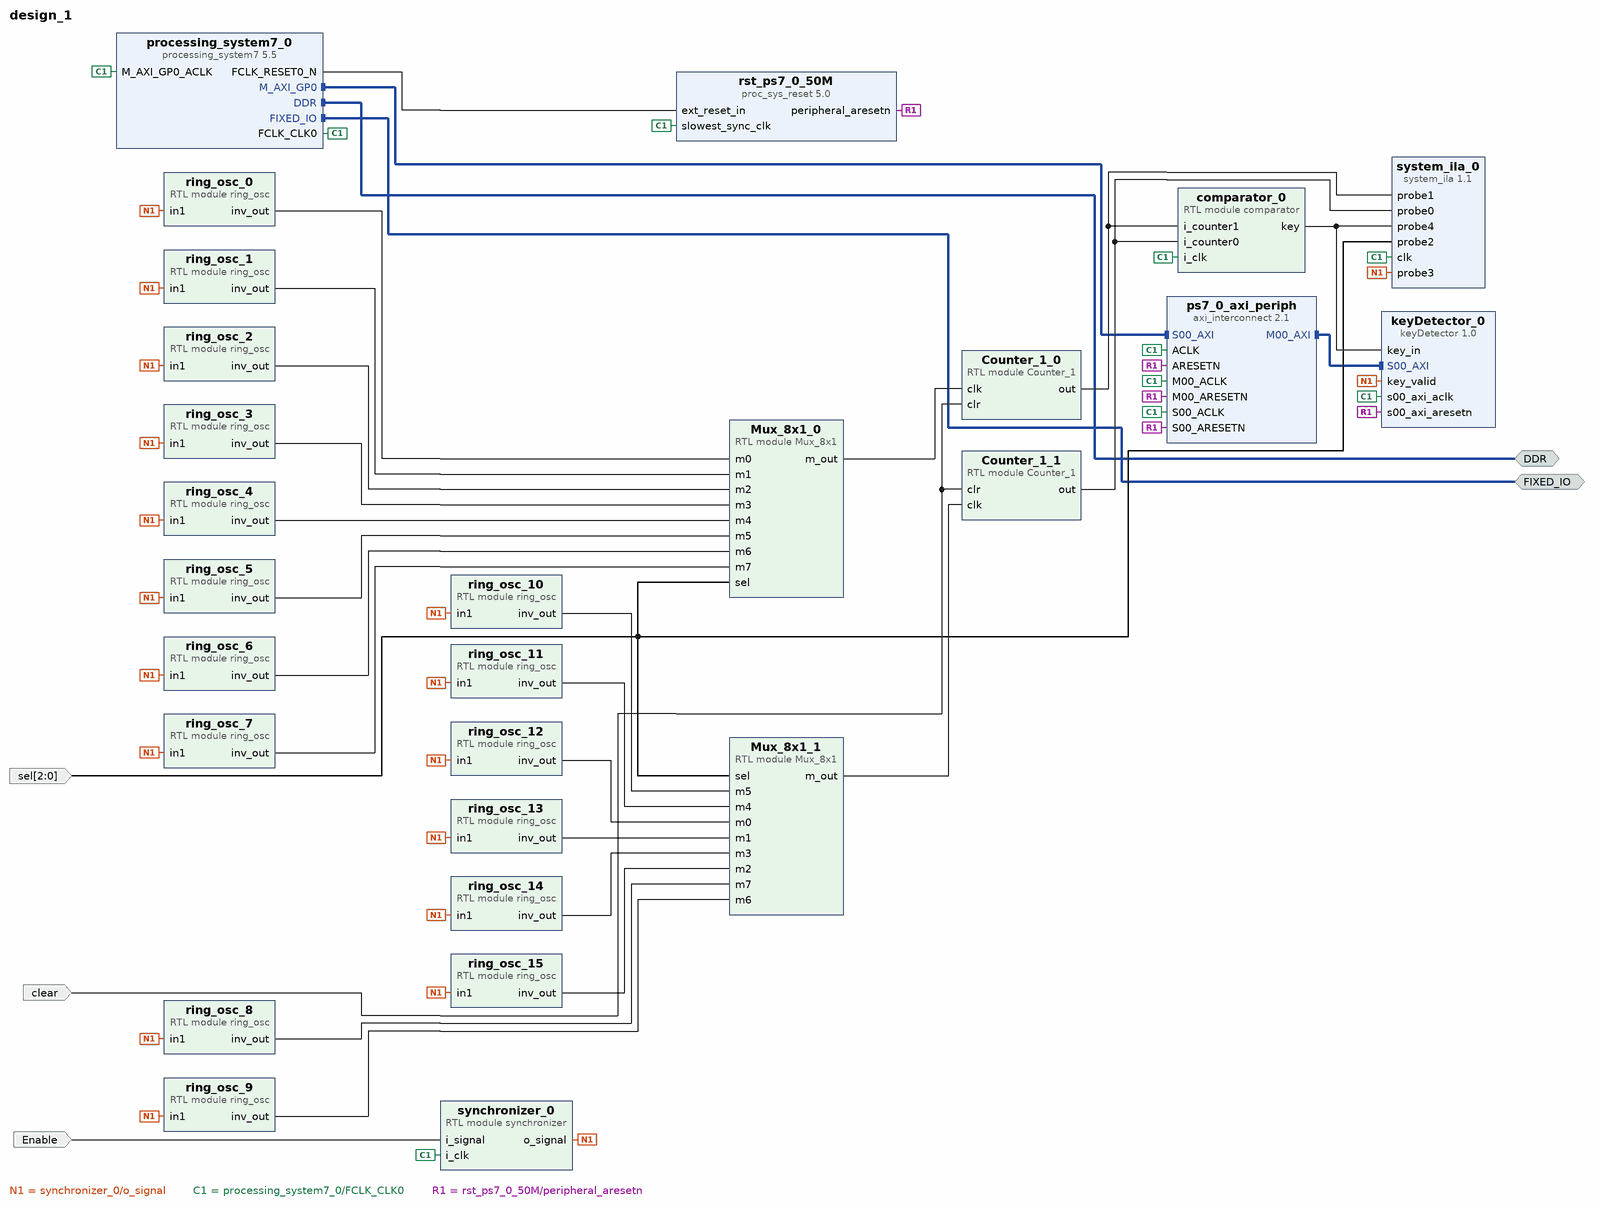
[diagram p0: block diagram of the top level]
# Vivado block design design_1, xc7z020clg400-1, Vivado 2021.1
create_bd_design design_1

create_bd_intf_port -mode Master -vlnv xilinx.com:interface:ddrx_rtl:1.0 DDR
create_bd_intf_port -mode Master -vlnv xilinx.com:display_processing_system7:fixedio_rtl:1.0 FIXED_IO
create_bd_port -dir I Enable
create_bd_port -dir I clear
create_bd_port -dir I -from 2 -to 0 sel

create_bd_cell -type ip -vlnv xilinx.com:ip:processing_system7:5.5 processing_system7_0
set_property -dict [list \
  CONFIG.PCW_APU_PERIPHERAL_FREQMHZ 666.666666 \
  CONFIG.PCW_CAN0_CAN0_IO {MIO 46 .. 47} \
  CONFIG.PCW_CAN0_PERIPHERAL_ENABLE 1 \
  CONFIG.PCW_CAN_PERIPHERAL_FREQMHZ 23.8095 \
  CONFIG.PCW_ENET0_ENET0_IO {MIO 16 .. 27} \
  CONFIG.PCW_ENET0_GRP_MDIO_ENABLE 1 \
  CONFIG.PCW_ENET0_GRP_MDIO_IO {MIO 52 .. 53} \
  CONFIG.PCW_ENET0_PERIPHERAL_ENABLE 1 \
  CONFIG.PCW_ENET0_PERIPHERAL_FREQMHZ {100 Mbps} \
  CONFIG.PCW_ENET0_RESET_ENABLE 1 \
  CONFIG.PCW_ENET0_RESET_IO {MIO 11} \
  CONFIG.PCW_ENET_RESET_ENABLE 1 \
  CONFIG.PCW_ENET_RESET_SELECT {Share reset pin} \
  CONFIG.PCW_FPGA0_PERIPHERAL_FREQMHZ 50 \
  CONFIG.PCW_FPGA1_PERIPHERAL_FREQMHZ 50 \
  CONFIG.PCW_GPIO_MIO_GPIO_ENABLE 1 \
  CONFIG.PCW_GPIO_MIO_GPIO_IO MIO \
  CONFIG.PCW_I2C0_GRP_INT_ENABLE 0 \
  CONFIG.PCW_I2C0_I2C0_IO {MIO 50 .. 51} \
  CONFIG.PCW_I2C0_PERIPHERAL_ENABLE 1 \
  CONFIG.PCW_I2C0_RESET_ENABLE 1 \
  CONFIG.PCW_I2C0_RESET_IO {MIO 13} \
  CONFIG.PCW_I2C_PERIPHERAL_FREQMHZ 111.111115 \
  CONFIG.PCW_I2C_RESET_ENABLE 1 \
  CONFIG.PCW_I2C_RESET_SELECT {Share reset pin} \
  CONFIG.PCW_PERIPHERAL_BOARD_PRESET part0 \
  CONFIG.PCW_PRESET_BANK0_VOLTAGE {LVCMOS 1.8V} \
  CONFIG.PCW_PRESET_BANK1_VOLTAGE {LVCMOS 1.8V} \
  CONFIG.PCW_QSPI_GRP_FBCLK_ENABLE 1 \
  CONFIG.PCW_QSPI_GRP_FBCLK_IO {MIO 8} \
  CONFIG.PCW_QSPI_GRP_SINGLE_SS_ENABLE 1 \
  CONFIG.PCW_QSPI_GRP_SINGLE_SS_IO {MIO 1 .. 6} \
  CONFIG.PCW_QSPI_PERIPHERAL_ENABLE 1 \
  CONFIG.PCW_QSPI_QSPI_IO {MIO 1 .. 6} \
  CONFIG.PCW_SD0_GRP_CD_ENABLE 1 \
  CONFIG.PCW_SD0_GRP_CD_IO {MIO 0} \
  CONFIG.PCW_SD0_GRP_WP_ENABLE 1 \
  CONFIG.PCW_SD0_GRP_WP_IO {MIO 15} \
  CONFIG.PCW_SD0_PERIPHERAL_ENABLE 1 \
  CONFIG.PCW_SD0_SD0_IO {MIO 40 .. 45} \
  CONFIG.PCW_SDIO_PERIPHERAL_FREQMHZ 50 \
  CONFIG.PCW_SINGLE_QSPI_DATA_MODE x4 \
  CONFIG.PCW_TTC0_PERIPHERAL_ENABLE 1 \
  CONFIG.PCW_TTC0_TTC0_IO EMIO \
  CONFIG.PCW_UART1_PERIPHERAL_ENABLE 1 \
  CONFIG.PCW_UART1_UART1_IO {MIO 48 .. 49} \
  CONFIG.PCW_UART_PERIPHERAL_FREQMHZ 50 \
  CONFIG.PCW_UIPARAM_DDR_FREQ_MHZ 533.333333 \
  CONFIG.PCW_UIPARAM_DDR_PARTNO {MT41K256M16 RE-125} \
  CONFIG.PCW_USB0_PERIPHERAL_ENABLE 1 \
  CONFIG.PCW_USB0_RESET_ENABLE 1 \
  CONFIG.PCW_USB0_RESET_IO {MIO 7} \
  CONFIG.PCW_USB0_USB0_IO {MIO 28 .. 39} \
  CONFIG.PCW_USB_RESET_ENABLE 1 \
  CONFIG.PCW_USB_RESET_SELECT {Share reset pin} \
  CONFIG.preset ZC702 \
] [get_bd_cells processing_system7_0]
# 507 more settings of processing_system7_0 are not shown: defaults, MIO pin electricals, DDR timing, and values the tool derives
create_bd_cell -type module -reference Mux_8x1 Mux_8x1_0
create_bd_cell -type module -reference synchronizer synchronizer_0
create_bd_cell -type module -reference Mux_8x1 Mux_8x1_1
create_bd_cell -type ip -vlnv xilinx.com:ip:system_ila:1.1 system_ila_0
set_property -dict [list \
  CONFIG.C_DATA_DEPTH 4096 \
  CONFIG.C_MON_TYPE NATIVE \
  CONFIG.C_NUM_OF_PROBES 5 \
  CONFIG.C_PROBE0_TYPE 0 \
] [get_bd_cells system_ila_0]
create_bd_cell -type module -reference Counter_1 Counter_1_0
create_bd_cell -type module -reference Counter_1 Counter_1_1
create_bd_cell -type module -reference ring_osc ring_osc_0
create_bd_cell -type module -reference ring_osc ring_osc_8
create_bd_cell -type module -reference ring_osc ring_osc_1
create_bd_cell -type module -reference ring_osc ring_osc_9
create_bd_cell -type module -reference ring_osc ring_osc_2
create_bd_cell -type module -reference ring_osc ring_osc_10
create_bd_cell -type module -reference ring_osc ring_osc_3
create_bd_cell -type module -reference ring_osc ring_osc_11
create_bd_cell -type module -reference ring_osc ring_osc_4
create_bd_cell -type module -reference ring_osc ring_osc_12
create_bd_cell -type module -reference ring_osc ring_osc_5
create_bd_cell -type module -reference ring_osc ring_osc_13
create_bd_cell -type module -reference ring_osc ring_osc_6
create_bd_cell -type module -reference ring_osc ring_osc_14
create_bd_cell -type module -reference ring_osc ring_osc_7
create_bd_cell -type module -reference ring_osc ring_osc_15
create_bd_cell -type module -reference comparator comparator_0
create_bd_cell -type ip -vlnv xilinx.com:user:keyDetector:1.0 keyDetector_0
create_bd_cell -type ip -vlnv xilinx.com:ip:axi_interconnect:2.1 ps7_0_axi_periph
set_property -dict {CONFIG.NUM_MI 1} [get_bd_cells ps7_0_axi_periph]
create_bd_cell -type ip -vlnv xilinx.com:ip:proc_sys_reset:5.0 rst_ps7_0_50M

# ---- connections ----

connect_bd_intf_net [get_bd_intf_ports DDR] [get_bd_intf_pins processing_system7_0/DDR]
connect_bd_intf_net [get_bd_intf_ports FIXED_IO] [get_bd_intf_pins processing_system7_0/FIXED_IO]
connect_bd_intf_net [get_bd_intf_pins processing_system7_0/M_AXI_GP0] [get_bd_intf_pins ps7_0_axi_periph/S00_AXI]
connect_bd_intf_net [get_bd_intf_pins ps7_0_axi_periph/M00_AXI] [get_bd_intf_pins keyDetector_0/S00_AXI]
connect_bd_net -net Counter_1_1_Countout [get_bd_pins Counter_1_0/out] [get_bd_pins system_ila_0/probe1] [get_bd_pins comparator_0/i_counter1]
connect_bd_net -net Countout [get_bd_pins Counter_1_1/out] [get_bd_pins system_ila_0/probe0] [get_bd_pins comparator_0/i_counter0]
connect_bd_net -net Enable_1 [get_bd_pins synchronizer_0/o_signal] \
  [get_bd_pins system_ila_0/probe3] [get_bd_pins ring_osc_0/in1] [get_bd_pins ring_osc_8/in1] [get_bd_pins ring_osc_1/in1] \
  [get_bd_pins ring_osc_9/in1] [get_bd_pins ring_osc_2/in1] [get_bd_pins ring_osc_10/in1] [get_bd_pins ring_osc_3/in1] \
  [get_bd_pins ring_osc_11/in1] [get_bd_pins ring_osc_4/in1] [get_bd_pins ring_osc_12/in1] [get_bd_pins ring_osc_5/in1] \
  [get_bd_pins ring_osc_13/in1] [get_bd_pins ring_osc_6/in1] [get_bd_pins ring_osc_14/in1] [get_bd_pins ring_osc_7/in1] \
  [get_bd_pins ring_osc_15/in1] [get_bd_pins keyDetector_0/key_valid]
connect_bd_net [get_bd_ports Enable] [get_bd_pins synchronizer_0/i_signal]
connect_bd_net [get_bd_pins Mux_8x1_0/m_out] [get_bd_pins Counter_1_0/clk]
connect_bd_net [get_bd_pins Mux_8x1_1/m_out] [get_bd_pins Counter_1_1/clk]
connect_bd_net [get_bd_ports clear] [get_bd_pins Counter_1_0/clr] [get_bd_pins Counter_1_1/clr]
connect_bd_net [get_bd_pins comparator_0/key] [get_bd_pins system_ila_0/probe4] [get_bd_pins keyDetector_0/key_in]
connect_bd_net -net inv_out [get_bd_pins ring_osc_0/inv_out] [get_bd_pins Mux_8x1_0/m0]
connect_bd_net [get_bd_pins processing_system7_0/FCLK_CLK0] \
  [get_bd_pins processing_system7_0/M_AXI_GP0_ACLK] [get_bd_pins synchronizer_0/i_clk] [get_bd_pins system_ila_0/clk] \
  [get_bd_pins comparator_0/i_clk] [get_bd_pins ps7_0_axi_periph/S00_ACLK] [get_bd_pins rst_ps7_0_50M/slowest_sync_clk] \
  [get_bd_pins keyDetector_0/s00_axi_aclk] [get_bd_pins ps7_0_axi_periph/M00_ACLK] [get_bd_pins ps7_0_axi_periph/ACLK]
connect_bd_net [get_bd_pins processing_system7_0/FCLK_RESET0_N] [get_bd_pins rst_ps7_0_50M/ext_reset_in]
connect_bd_net [get_bd_pins ring_osc_10/inv_out] [get_bd_pins Mux_8x1_1/m5]
connect_bd_net [get_bd_pins ring_osc_11/inv_out] [get_bd_pins Mux_8x1_1/m4]
connect_bd_net [get_bd_pins ring_osc_12/inv_out] [get_bd_pins Mux_8x1_1/m0]
connect_bd_net [get_bd_pins ring_osc_13/inv_out] [get_bd_pins Mux_8x1_1/m1]
connect_bd_net [get_bd_pins ring_osc_14/inv_out] [get_bd_pins Mux_8x1_1/m3]
connect_bd_net [get_bd_pins ring_osc_15/inv_out] [get_bd_pins Mux_8x1_1/m2]
connect_bd_net [get_bd_pins ring_osc_1/inv_out] [get_bd_pins Mux_8x1_0/m1]
connect_bd_net [get_bd_pins ring_osc_2/inv_out] [get_bd_pins Mux_8x1_0/m2]
connect_bd_net [get_bd_pins ring_osc_3/inv_out] [get_bd_pins Mux_8x1_0/m3]
connect_bd_net [get_bd_pins ring_osc_4/inv_out] [get_bd_pins Mux_8x1_0/m4]
connect_bd_net [get_bd_pins ring_osc_5/inv_out] [get_bd_pins Mux_8x1_0/m5]
connect_bd_net [get_bd_pins ring_osc_6/inv_out] [get_bd_pins Mux_8x1_0/m6]
connect_bd_net [get_bd_pins ring_osc_7/inv_out] [get_bd_pins Mux_8x1_0/m7]
connect_bd_net [get_bd_pins ring_osc_8/inv_out] [get_bd_pins Mux_8x1_1/m7]
connect_bd_net [get_bd_pins ring_osc_9/inv_out] [get_bd_pins Mux_8x1_1/m6]
connect_bd_net [get_bd_pins rst_ps7_0_50M/peripheral_aresetn] \
  [get_bd_pins ps7_0_axi_periph/S00_ARESETN] [get_bd_pins keyDetector_0/s00_axi_aresetn] \
  [get_bd_pins ps7_0_axi_periph/M00_ARESETN] [get_bd_pins ps7_0_axi_periph/ARESETN]
connect_bd_net [get_bd_ports sel] [get_bd_pins Mux_8x1_0/sel] [get_bd_pins Mux_8x1_1/sel] [get_bd_pins system_ila_0/probe2]
set_property HDL_ATTRIBUTE.DEBUG true [get_bd_nets Countout]
set_property HDL_ATTRIBUTE.MARK_DEBUG true [get_bd_nets Countout]

# ---- address map ----
assign_bd_address -offset 0x43C00000 -range 64K -target_address_space [get_bd_addr_spaces processing_system7_0/Data] [get_bd_addr_segs keyDetector_0/S00_AXI/S00_AXI_reg]

validate_bd_design
save_bd_design
